# Altium schematic sheet norbi_lm_pl_iss.SchDoc: Имя
size 410 x 297 mm; ApprovedBy: Утвердил; CheckedBy: Проверил; Author: Разработал; Organization: НГУ; DocumentNumber: Децимальный номер Э3; SheetNumber: Лист; SheetTotal: Листов; PageSetup: Record=PageOptions|CenterHorizontal=True|CenterVertical=True|PrintScale=1.00|XCorrection=1.00|YCorrection=1.00|PrintKind=1|BorderSize=5000000|LeftOffset=0|BottomOffset=0|Orientation=2|PaperLength=1000|PaperWidth=1000|Scale=100|PaperSource=15|PrintQuality=1200|MediaType=1|DitherType=10|PaperKind=A3|PrintScaleMode=1; Weight: -; ScaleFactor: -; NormInspection: Норм.Контр.
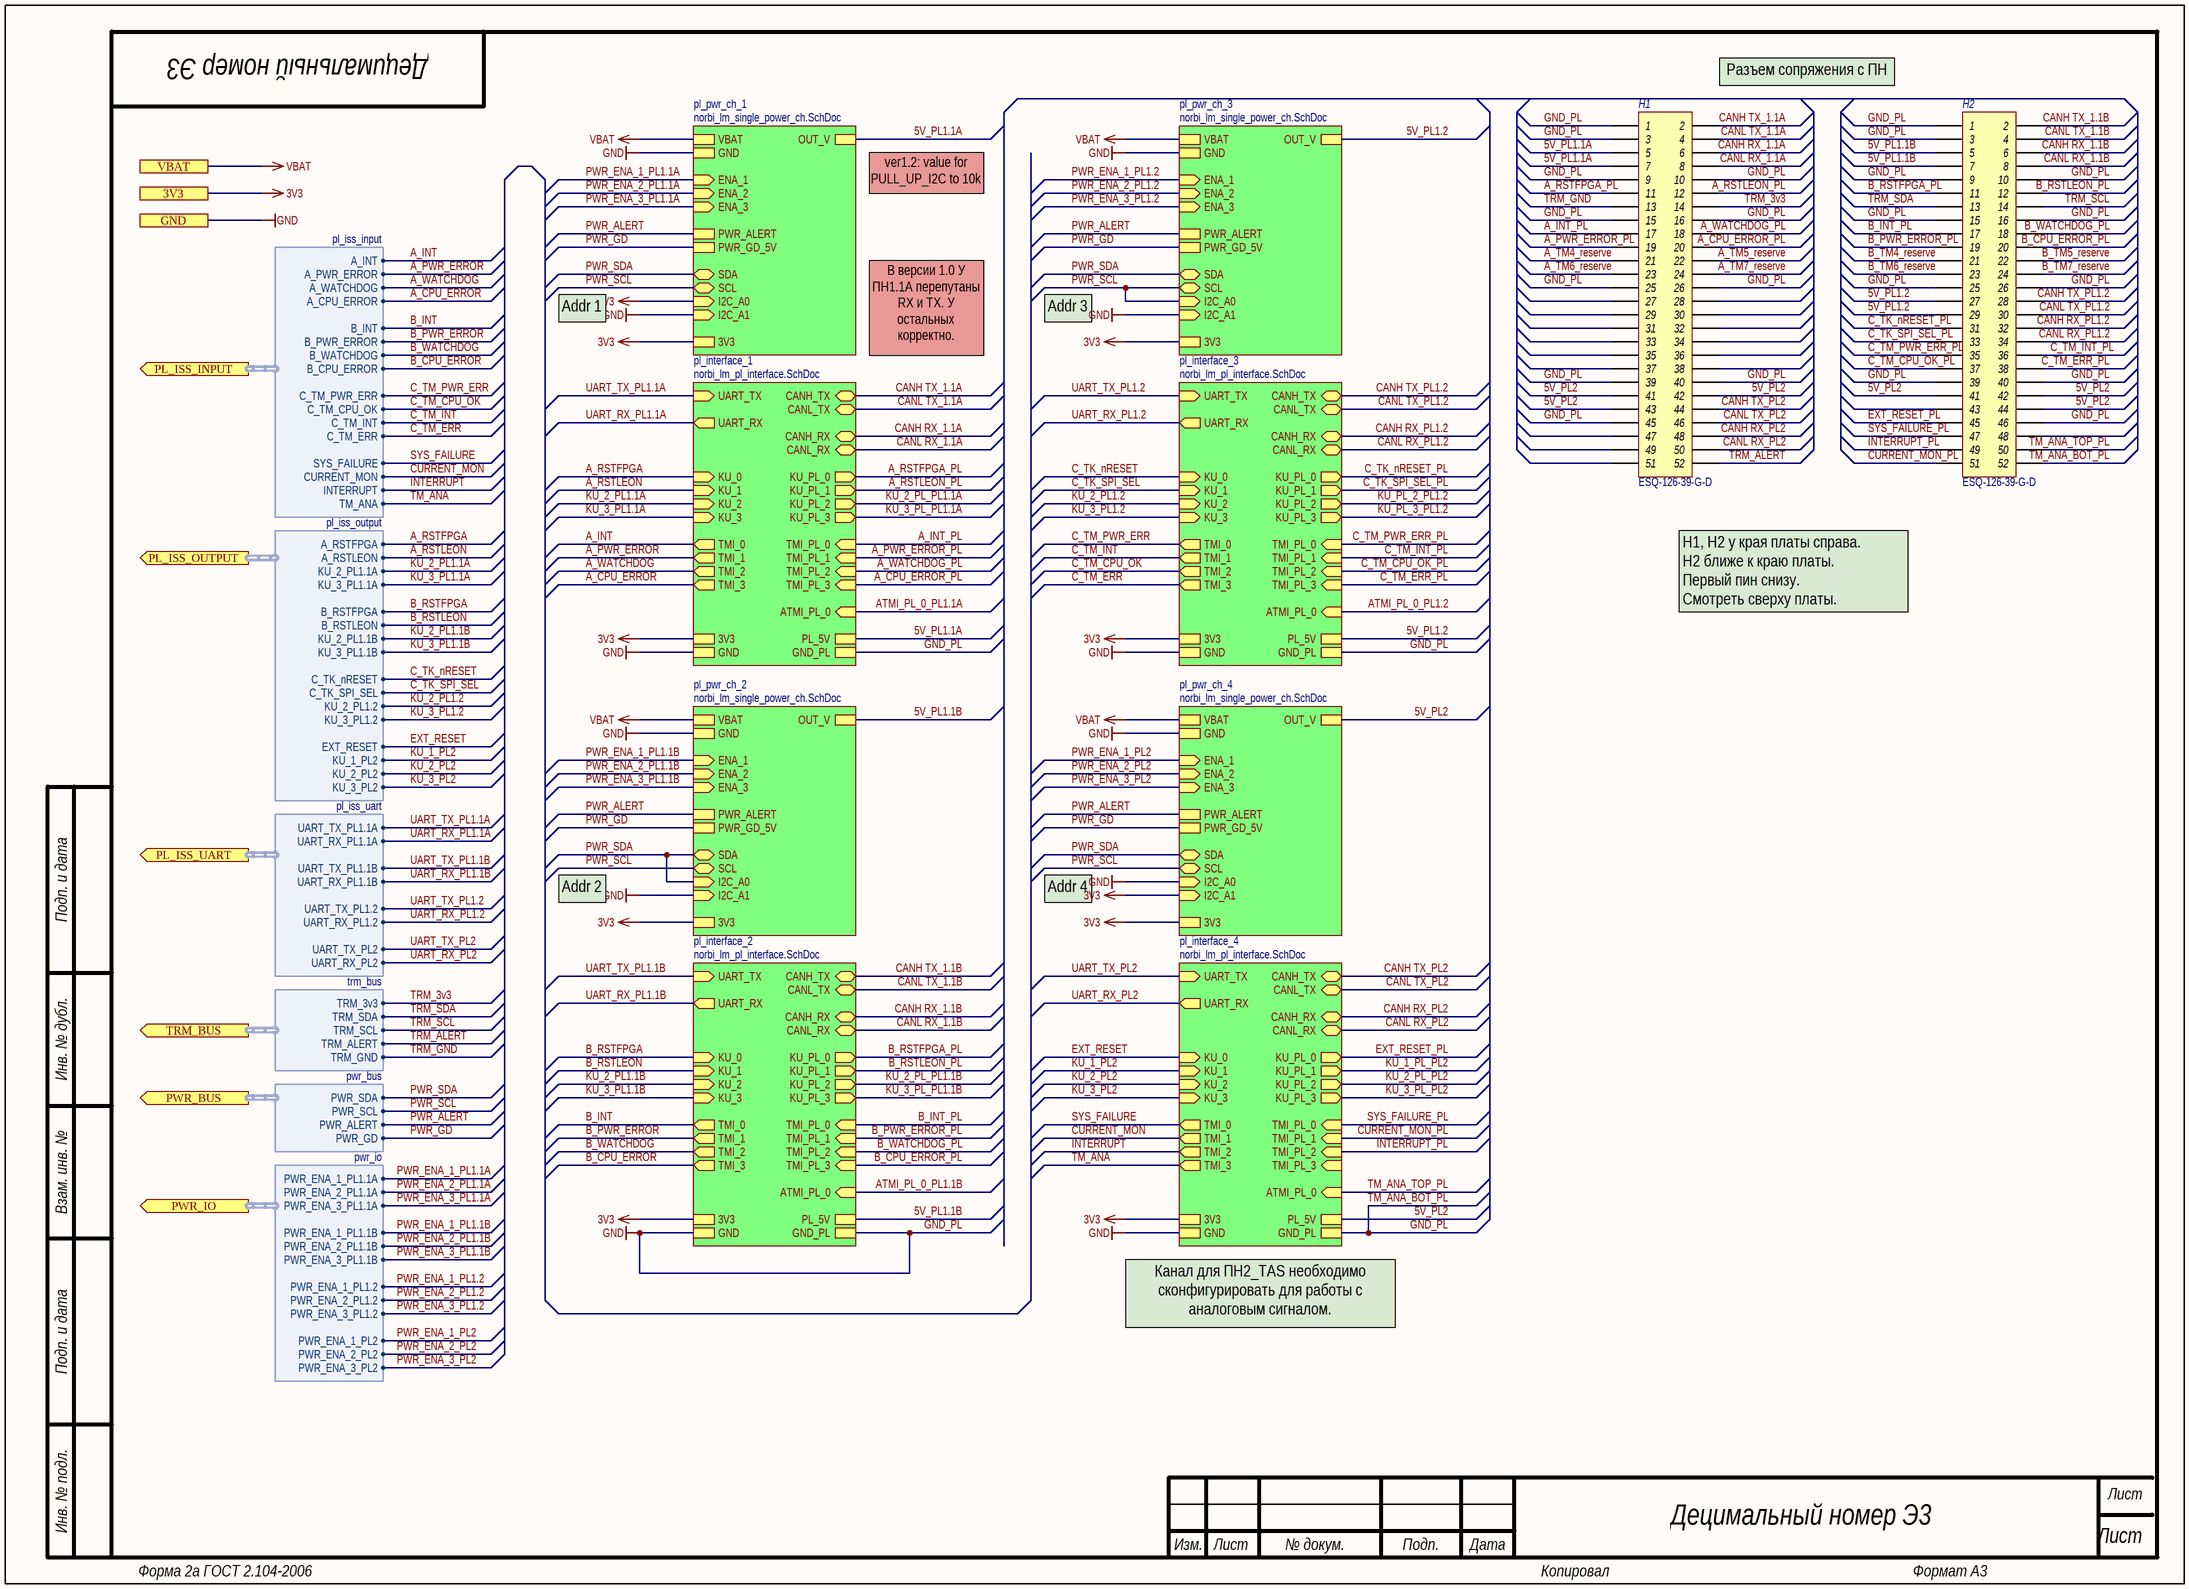
[diagram p0: norbi_lm_pl_iss.SchDoc]

## Parts
H1  ESQ-126-39-G-D  [ESQ-126-39-G-D]
H2  ESQ-126-39-G-D  [ESQ-126-39-G-D]

## Sub-sheets
pl_interface_1 = norbi_lm_pl_interface.SchDoc: KU_2 (in), CANL_TX (bidir), TMI_1 (out), KU_0 (in), TMI_0 (out), TMI_2 (out), TMI_3 (out), CANL_RX (bidir), CANH_TX (bidir), KU_3 (in), CANH_RX (bidir), KU_1 (in), TMI_PL_3 (in), KU_PL_1 (out), TMI_PL_2 (in), TMI_PL_1 (in), KU_PL_0 (out), TMI_PL_0 (in), KU_PL_3 (out), KU_PL_2 (out), ATMI_PL_0 (in), PL_5V, UART_RX (out), GND, GND_PL, UART_TX (in), 3V3
pl_interface_2 = norbi_lm_pl_interface.SchDoc: KU_2 (in), CANL_TX (bidir), TMI_1 (out), KU_0 (in), TMI_0 (out), TMI_2 (out), TMI_3 (out), CANL_RX (bidir), CANH_TX (bidir), KU_3 (in), CANH_RX (bidir), KU_1 (in), TMI_PL_3 (in), KU_PL_1 (out), TMI_PL_2 (in), TMI_PL_1 (in), KU_PL_0 (out), TMI_PL_0 (in), KU_PL_3 (out), KU_PL_2 (out), ATMI_PL_0 (in), PL_5V, UART_RX (out), GND, GND_PL, UART_TX (in), 3V3
pl_interface_3 = norbi_lm_pl_interface.SchDoc: KU_2 (in), CANL_TX (bidir), TMI_1 (out), KU_0 (in), TMI_0 (out), TMI_2 (out), TMI_3 (out), CANL_RX (bidir), CANH_TX (bidir), KU_3 (in), CANH_RX (bidir), KU_1 (in), TMI_PL_3 (in), KU_PL_1 (out), TMI_PL_2 (in), TMI_PL_1 (in), KU_PL_0 (out), TMI_PL_0 (in), KU_PL_3 (out), KU_PL_2 (out), ATMI_PL_0 (in), PL_5V, UART_RX (out), GND, GND_PL, UART_TX (in), 3V3
pl_interface_4 = norbi_lm_pl_interface.SchDoc: KU_2 (in), CANL_TX (bidir), TMI_1 (out), KU_0 (in), TMI_0 (out), TMI_2 (out), TMI_3 (out), CANL_RX (bidir), CANH_TX (bidir), KU_3 (in), CANH_RX (bidir), KU_1 (in), TMI_PL_3 (in), KU_PL_1 (out), TMI_PL_2 (in), TMI_PL_1 (in), KU_PL_0 (out), TMI_PL_0 (in), KU_PL_3 (out), KU_PL_2 (out), ATMI_PL_0 (in), PL_5V, UART_RX (out), GND, GND_PL, UART_TX (in), 3V3
pl_pwr_ch_1 = norbi_lm_single_power_ch.SchDoc: SDA (bidir), SCL (bidir), ENA_1 (in), ENA_2 (in), ENA_3 (in), I2C_A0 (in), I2C_A1 (in), VBAT, 3V3, GND, PWR_ALERT, PWR_GD_5V, OUT_V  | R17_value: 1М; R22_value: 100; R21_value: 100; R20_value: 100; R18_value: 300к; R27_value: NU; R1_5V_value: 160к; R2_5V_value: 30к; PULL_UP_I2C: 10к
pl_pwr_ch_2 = norbi_lm_single_power_ch.SchDoc: SDA (bidir), SCL (bidir), ENA_1 (in), ENA_2 (in), ENA_3 (in), I2C_A0 (in), I2C_A1 (in), VBAT, 3V3, GND, PWR_ALERT, PWR_GD_5V, OUT_V  | R17_value: 1М; R22_value: 100; R21_value: 100; R20_value: 100; R18_value: 300к; R27_value: NU; R1_5V_value: 160к; R2_5V_value: 30к; PULL_UP_I2C: NU
pl_pwr_ch_3 = norbi_lm_single_power_ch.SchDoc: SDA (bidir), SCL (bidir), ENA_1 (in), ENA_2 (in), ENA_3 (in), I2C_A0 (in), I2C_A1 (in), VBAT, 3V3, GND, PWR_ALERT, PWR_GD_5V, OUT_V  | R17_value: 1М; R22_value: 100; R21_value: 100; R20_value: 100; R18_value: 300к; R27_value: NU; R1_5V_value: 160к; R2_5V_value: 30к; PULL_UP_I2C: NU
pl_pwr_ch_4 = norbi_lm_single_power_ch.SchDoc: SDA (bidir), SCL (bidir), ENA_1 (in), ENA_2 (in), ENA_3 (in), I2C_A0 (in), I2C_A1 (in), VBAT, 3V3, GND, PWR_ALERT, PWR_GD_5V, OUT_V  | R17_value: 1М; R22_value: 100; R21_value: 100; R20_value: 100; R18_value: 300к; R27_value: NU; R1_5V_value: 160к; R2_5V_value: 30к; PULL_UP_I2C: NU

## Ports
3V3, GND, PL_ISS_INPUT (out, harness pl_iss_input), PL_ISS_OUTPUT (out, harness pl_iss_output), PL_ISS_UART (out, harness pl_iss_uart), PWR_BUS (out, harness pwr_bus), PWR_IO (out, harness pwr_io), TRM_BUS (out, harness trm_bus), VBAT

## Harnesses
pl_iss_input: A_INT, A_PWR_ERROR, A_WATCHDOG, A_CPU_ERROR, B_INT, B_PWR_ERROR, B_WATCHDOG, B_CPU_ERROR, C_TM_PWR_ERR, C_TM_CPU_OK, C_TM_INT, C_TM_ERR, SYS_FAILURE, CURRENT_MON, INTERRUPT, TM_ANA
pl_iss_output: A_RSTFPGA, A_RSTLEON, KU_2_PL1.1A, KU_3_PL1.1A, B_RSTFPGA, B_RSTLEON, KU_2_PL1.1B, KU_3_PL1.1B, C_TK_nRESET, C_TK_SPI_SEL, KU_2_PL1.2, KU_3_PL1.2, EXT_RESET, KU_1_PL2, KU_2_PL2, KU_3_PL2
pl_iss_uart: UART_TX_PL1.1A, UART_RX_PL1.1A, UART_TX_PL1.1B, UART_RX_PL1.1B, UART_TX_PL1.2, UART_RX_PL1.2, UART_TX_PL2, UART_RX_PL2
trm_bus: TRM_3v3, TRM_SDA, TRM_SCL, TRM_ALERT, TRM_GND
pwr_bus: PWR_SDA, PWR_SCL, PWR_ALERT, PWR_GD
pwr_io: PWR_ENA_1_PL1.1A, PWR_ENA_2_PL1.1A, PWR_ENA_3_PL1.1A, PWR_ENA_1_PL1.1B, PWR_ENA_2_PL1.1B, PWR_ENA_3_PL1.1B, PWR_ENA_1_PL1.2, PWR_ENA_2_PL1.2, PWR_ENA_3_PL1.2, PWR_ENA_1_PL2, PWR_ENA_2_PL2, PWR_ENA_3_PL2

## Nets
3V3: port 3V3, sheet pl_interface_1/3V3, sheet pl_interface_2/3V3, sheet pl_interface_3/3V3, sheet pl_interface_4/3V3, sheet pl_pwr_ch_1/I2C_A0, sheet pl_pwr_ch_1/3V3, sheet pl_pwr_ch_2/3V3, sheet pl_pwr_ch_3/3V3, sheet pl_pwr_ch_4/I2C_A1, sheet pl_pwr_ch_4/3V3
GND_PL: H1.1 H1.3 H1.9 H1.10 H1.15 H1.16 H1.25 H1.26 H1.39 H1.40 H1.45 H2.1 H2.3 H2.9 H2.10 H2.15 H2.16 H2.25 H2.26 H2.39 H2.40 H2.46 H2.52 ; port GND, sheet pl_interface_1/GND, sheet pl_interface_1/GND_PL, sheet pl_interface_2/GND, sheet pl_interface_2/GND_PL, sheet pl_interface_3/GND, sheet pl_interface_3/GND_PL, sheet pl_interface_4/GND, sheet pl_interface_4/GND_PL, sheet pl_pwr_ch_1/I2C_A1, sheet pl_pwr_ch_1/GND, sheet pl_pwr_ch_2/I2C_A1, sheet pl_pwr_ch_2/GND, sheet pl_pwr_ch_3/I2C_A1, sheet pl_pwr_ch_3/GND, sheet pl_pwr_ch_4/I2C_A0, sheet pl_pwr_ch_4/GND  [also labelled GND, TM_ANA_BOT_PL]
VBAT: port VBAT, sheet pl_pwr_ch_1/VBAT, sheet pl_pwr_ch_2/VBAT, sheet pl_pwr_ch_3/VBAT, sheet pl_pwr_ch_4/VBAT
5V_PL1.1B: H2.5 H2.7 ; sheet pl_interface_2/PL_5V, sheet pl_pwr_ch_2/OUT_V
5V_PL1.1А: H1.5 H1.7 ; sheet pl_interface_1/PL_5V, sheet pl_pwr_ch_1/OUT_V
5V_PL1.2: H2.27 H2.29 ; sheet pl_interface_3/PL_5V, sheet pl_pwr_ch_3/OUT_V
5V_PL2: H1.41 H1.42 H1.43 H2.41 H2.42 H2.44 ; sheet pl_interface_4/PL_5V, sheet pl_pwr_ch_4/OUT_V
A_CPU_ERROR: sheet pl_interface_1/TMI_3, port PL_ISS_INPUT.A_CPU_ERROR
A_CPU_ERROR_PL: H1.20 ; sheet pl_interface_1/TMI_PL_3
A_INT: sheet pl_interface_1/TMI_0, port PL_ISS_INPUT.A_INT
A_INT_PL: H1.17 ; sheet pl_interface_1/TMI_PL_0
A_PWR_ERROR: sheet pl_interface_1/TMI_1, port PL_ISS_INPUT.A_PWR_ERROR
A_PWR_ERROR_PL: H1.19 ; sheet pl_interface_1/TMI_PL_1
A_RSTFPGA: sheet pl_interface_1/KU_0, port PL_ISS_OUTPUT.A_RSTFPGA
A_RSTFPGA_PL: H1.11 ; sheet pl_interface_1/KU_PL_0
A_RSTLEON: sheet pl_interface_1/KU_1, port PL_ISS_OUTPUT.A_RSTLEON
A_RSTLEON_PL: H1.12 ; sheet pl_interface_1/KU_PL_1
A_TM4_reserve: H1.21
A_TM5_reserve: H1.22
A_TM6_reserve: H1.23
A_TM7_reserve: H1.24
A_WATCHDOG: sheet pl_interface_1/TMI_2, port PL_ISS_INPUT.A_WATCHDOG
A_WATCHDOG_PL: H1.18 ; sheet pl_interface_1/TMI_PL_2
ATMI_PL_0_PL1.1A: sheet pl_interface_1/ATMI_PL_0
ATMI_PL_0_PL1.1B: sheet pl_interface_2/ATMI_PL_0
ATMI_PL_0_PL1.2: sheet pl_interface_3/ATMI_PL_0
B_CPU_ERROR: sheet pl_interface_2/TMI_3, port PL_ISS_INPUT.B_CPU_ERROR
B_CPU_ERROR_PL: H2.20 ; sheet pl_interface_2/TMI_PL_3
B_INT: sheet pl_interface_2/TMI_0, port PL_ISS_INPUT.B_INT
B_INT_PL: H2.17 ; sheet pl_interface_2/TMI_PL_0
B_PWR_ERROR: sheet pl_interface_2/TMI_1, port PL_ISS_INPUT.B_PWR_ERROR
B_PWR_ERROR_PL: H2.19 ; sheet pl_interface_2/TMI_PL_1
B_RSTFPGA: sheet pl_interface_2/KU_0, port PL_ISS_OUTPUT.B_RSTFPGA
B_RSTFPGA_PL: H2.11 ; sheet pl_interface_2/KU_PL_0
B_RSTLEON: sheet pl_interface_2/KU_1, port PL_ISS_OUTPUT.B_RSTLEON
B_RSTLEON_PL: H2.12 ; sheet pl_interface_2/KU_PL_1
B_TM4_reserve: H2.21
B_TM5_reserve: H2.22
B_TM6_reserve: H2.23
B_TM7_reserve: H2.24
B_WATCHDOG: sheet pl_interface_2/TMI_2, port PL_ISS_INPUT.B_WATCHDOG
B_WATCHDOG_PL: H2.18 ; sheet pl_interface_2/TMI_PL_2
C_TK_nRESET: sheet pl_interface_3/KU_0, port PL_ISS_OUTPUT.C_TK_nRESET
C_TK_nRESET_PL: H2.31 ; sheet pl_interface_3/KU_PL_0
C_TK_SPI_SEL: sheet pl_interface_3/KU_1, port PL_ISS_OUTPUT.C_TK_SPI_SEL
C_TK_SPI_SEL_PL: H2.33 ; sheet pl_interface_3/KU_PL_1
C_TM_CPU_OK: sheet pl_interface_3/TMI_2, port PL_ISS_INPUT.C_TM_CPU_OK
C_TM_CPU_OK_PL: H2.37 ; sheet pl_interface_3/TMI_PL_2
C_TM_ERR: sheet pl_interface_3/TMI_3, port PL_ISS_INPUT.C_TM_ERR
C_TM_ERR_PL: H2.38 ; sheet pl_interface_3/TMI_PL_3
C_TM_INT: sheet pl_interface_3/TMI_1, port PL_ISS_INPUT.C_TM_INT
C_TM_INT_PL: H2.36 ; sheet pl_interface_3/TMI_PL_1
C_TM_PWR_ERR: sheet pl_interface_3/TMI_0, port PL_ISS_INPUT.C_TM_PWR_ERR
C_TM_PWR_ERR_PL: H2.35 ; sheet pl_interface_3/TMI_PL_0
CANH RX_1.1A: H1.6 ; sheet pl_interface_1/CANH_RX
CANH RX_1.1B: H2.6 ; sheet pl_interface_2/CANH_RX
CANH RX_PL1.2: H2.32 ; sheet pl_interface_3/CANH_RX
CANH RX_PL2: H1.48 ; sheet pl_interface_4/CANH_RX
CANH TX_1.1A: H1.2 ; sheet pl_interface_1/CANH_TX
CANH TX_1.1B: H2.2 ; sheet pl_interface_2/CANH_TX
CANH TX_PL1.2: H2.28 ; sheet pl_interface_3/CANH_TX
CANH TX_PL2: H1.44 ; sheet pl_interface_4/CANH_TX
CANL RX_1.1A: H1.8 ; sheet pl_interface_1/CANL_RX
CANL RX_1.1B: H2.8 ; sheet pl_interface_2/CANL_RX
CANL RX_PL1.2: H2.34 ; sheet pl_interface_3/CANL_RX
CANL RX_PL2: H1.50 ; sheet pl_interface_4/CANL_RX
CANL TX_1.1A: H1.4 ; sheet pl_interface_1/CANL_TX
CANL TX_1.1B: H2.4 ; sheet pl_interface_2/CANL_TX
CANL TX_PL1.2: H2.30 ; sheet pl_interface_3/CANL_TX
CANL TX_PL2: H1.46 ; sheet pl_interface_4/CANL_TX
CURRENT_MON: sheet pl_interface_4/TMI_1, port PL_ISS_INPUT.CURRENT_MON
CURRENT_MON_PL: H2.51 ; sheet pl_interface_4/TMI_PL_1
EXT_RESET: sheet pl_interface_4/KU_0, port PL_ISS_OUTPUT.EXT_RESET
EXT_RESET_PL: H2.45 ; sheet pl_interface_4/KU_PL_0
INTERRUPT: sheet pl_interface_4/TMI_2, port PL_ISS_INPUT.INTERRUPT
INTERRUPT_PL: H2.49 ; sheet pl_interface_4/TMI_PL_2
KU_1_PL2: sheet pl_interface_4/KU_1, port PL_ISS_OUTPUT.KU_1_PL2
KU_1_PL_PL2: sheet pl_interface_4/KU_PL_1
KU_2_PL1.1A: sheet pl_interface_1/KU_2, port PL_ISS_OUTPUT.KU_2_PL1.1A
KU_2_PL1.1B: sheet pl_interface_2/KU_2, port PL_ISS_OUTPUT.KU_2_PL1.1B
KU_2_PL1.2: sheet pl_interface_3/KU_2, port PL_ISS_OUTPUT.KU_2_PL1.2
KU_2_PL2: sheet pl_interface_4/KU_2, port PL_ISS_OUTPUT.KU_2_PL2
KU_2_PL_PL1.1A: sheet pl_interface_1/KU_PL_2
KU_2_PL_PL1.1B: sheet pl_interface_2/KU_PL_2
KU_2_PL_PL2: sheet pl_interface_4/KU_PL_2
KU_3_PL1.1A: sheet pl_interface_1/KU_3, port PL_ISS_OUTPUT.KU_3_PL1.1A
KU_3_PL1.1B: sheet pl_interface_2/KU_3, port PL_ISS_OUTPUT.KU_3_PL1.1B
KU_3_PL1.2: sheet pl_interface_3/KU_3, port PL_ISS_OUTPUT.KU_3_PL1.2
KU_3_PL2: sheet pl_interface_4/KU_3, port PL_ISS_OUTPUT.KU_3_PL2
KU_3_PL_PL1.1A: sheet pl_interface_1/KU_PL_3
KU_3_PL_PL1.1B: sheet pl_interface_2/KU_PL_3
KU_3_PL_PL2: sheet pl_interface_4/KU_PL_3
KU_PL_2_PL1.2: sheet pl_interface_3/KU_PL_2
KU_PL_3_PL1.2: sheet pl_interface_3/KU_PL_3
PWR_ALERT: sheet pl_pwr_ch_1/PWR_ALERT, sheet pl_pwr_ch_2/PWR_ALERT, sheet pl_pwr_ch_3/PWR_ALERT, sheet pl_pwr_ch_4/PWR_ALERT, port PWR_BUS.PWR_ALERT
PWR_ENA_1_PL1.1A: sheet pl_pwr_ch_1/ENA_1, port PWR_IO.PWR_ENA_1_PL1.1A
PWR_ENA_1_PL1.1B: sheet pl_pwr_ch_2/ENA_1, port PWR_IO.PWR_ENA_1_PL1.1B
PWR_ENA_1_PL1.2: sheet pl_pwr_ch_3/ENA_1, port PWR_IO.PWR_ENA_1_PL1.2
PWR_ENA_1_PL2: sheet pl_pwr_ch_4/ENA_1, port PWR_IO.PWR_ENA_1_PL2
PWR_ENA_2_PL1.1A: sheet pl_pwr_ch_1/ENA_2, port PWR_IO.PWR_ENA_2_PL1.1A
PWR_ENA_2_PL1.1B: sheet pl_pwr_ch_2/ENA_2, port PWR_IO.PWR_ENA_2_PL1.1B
PWR_ENA_2_PL1.2: sheet pl_pwr_ch_3/ENA_2, port PWR_IO.PWR_ENA_2_PL1.2
PWR_ENA_2_PL2: sheet pl_pwr_ch_4/ENA_2, port PWR_IO.PWR_ENA_2_PL2
PWR_ENA_3_PL1.1A: sheet pl_pwr_ch_1/ENA_3, port PWR_IO.PWR_ENA_3_PL1.1A
PWR_ENA_3_PL1.1B: sheet pl_pwr_ch_2/ENA_3, port PWR_IO.PWR_ENA_3_PL1.1B
PWR_ENA_3_PL1.2: sheet pl_pwr_ch_3/ENA_3, port PWR_IO.PWR_ENA_3_PL1.2
PWR_ENA_3_PL2: sheet pl_pwr_ch_4/ENA_3, port PWR_IO.PWR_ENA_3_PL2
PWR_GD: sheet pl_pwr_ch_1/PWR_GD_5V, sheet pl_pwr_ch_2/PWR_GD_5V, sheet pl_pwr_ch_3/PWR_GD_5V, sheet pl_pwr_ch_4/PWR_GD_5V, port PWR_BUS.PWR_GD
PWR_SCL: sheet pl_pwr_ch_1/SCL, sheet pl_pwr_ch_2/SCL, sheet pl_pwr_ch_3/SCL, sheet pl_pwr_ch_3/I2C_A0, sheet pl_pwr_ch_4/SCL, port PWR_BUS.PWR_SCL
PWR_SDA: sheet pl_pwr_ch_1/SDA, sheet pl_pwr_ch_2/SDA, sheet pl_pwr_ch_2/I2C_A0, sheet pl_pwr_ch_3/SDA, sheet pl_pwr_ch_4/SDA, port PWR_BUS.PWR_SDA
SYS_FAILURE: sheet pl_interface_4/TMI_0, port PL_ISS_INPUT.SYS_FAILURE
SYS_FAILURE_PL: H2.47 ; sheet pl_interface_4/TMI_PL_0
TM_ANA: sheet pl_interface_4/TMI_3, port PL_ISS_INPUT.TM_ANA
TM_ANA_TOP_PL: H2.50 ; sheet pl_interface_4/ATMI_PL_0
TRM_3v3: H1.14 ; port TRM_BUS.TRM_3v3
TRM_ALERT: H1.52 ; port TRM_BUS.TRM_ALERT
TRM_GND: H1.13 ; port TRM_BUS.TRM_GND
TRM_SCL: H2.14 ; port TRM_BUS.TRM_SCL
TRM_SDA: H2.13 ; port TRM_BUS.TRM_SDA
UART_RX_PL1.1A: sheet pl_interface_1/UART_RX, port PL_ISS_UART.UART_RX_PL1.1A
UART_RX_PL1.1B: sheet pl_interface_2/UART_RX, port PL_ISS_UART.UART_RX_PL1.1B
UART_RX_PL1.2: sheet pl_interface_3/UART_RX, port PL_ISS_UART.UART_RX_PL1.2
UART_RX_PL2: sheet pl_interface_4/UART_RX, port PL_ISS_UART.UART_RX_PL2
UART_TX_PL1.1A: sheet pl_interface_1/UART_TX, port PL_ISS_UART.UART_TX_PL1.1A
UART_TX_PL1.1B: sheet pl_interface_2/UART_TX, port PL_ISS_UART.UART_TX_PL1.1B
UART_TX_PL1.2: sheet pl_interface_3/UART_TX, port PL_ISS_UART.UART_TX_PL1.2
UART_TX_PL2: sheet pl_interface_4/UART_TX, port PL_ISS_UART.UART_TX_PL2

Not connected (* = marked no-connect by the designer): H1 27 28 29 30 31 32 33 34 35 36 37 38 47 49 51; H2 43 48

## Notes on the sheet
- (near H1) Разъем сопряжения с ПН
- ver1.2: value for PULL_UP_I2C to 10k
- Addr 1
- Addr 3
- В версии 1.0 У ПН1.1А перепутаны RX и TX. У остальных корректно.
- H1, H2 у края платы справа.
  H2 ближе к краю платы.
  Первый пин снизу.
  Смотреть сверху платы.
- Addr 2
- Addr 4
- Канал для ПН2_TAS необходимо сконфигурировать для работы с аналоговым сигналом.
- Подп. и дата
- Инв. № дубл.
- Взам. инв. №
- Инв. № подл.
- Изм.
- Лист
- № докум.
- Подп.
- Дата
- Форма 2а ГОСТ 2.104-2006
- Копировал
- Формат А3

## Library data of the parts
H1 H2 = ESQ-126-39-G-D: Elevated socket, dual-row, 26-pin per row; Назначение: Сквозной разъем, двойно, 52 контакта, шаг 2,54 мм; Потребление, Вт: 0,00; Наименование: ESQ-126-39-G-D